# Altium schematic sheet BalEv_FPTG_POW_COFIG_v1_0.SchDoc
size A4; CompanyName: HESSO; Address1: Route du Rawyl 47; Address2: 1950 Sion; Address3: Switzerland; DocumentNumber: 5; SheetNumber: 4; SheetTotal: 8; PageSetup: Record=PageOptions|CenterHorizontal=True|CenterVertical=True|PrintScale=1.00|XCorrection=1.00|YCorrection=1.00|PrintKind=1|BorderSize=5000000|LeftOffset=0|BottomOffset=0|Orientation=2|PaperLength=1000|PaperWidth=1000|Scale=100|PaperSource=15|PrintQuality=1200|MediaType=1|DitherType=10|PrintScaleMode=1|PaperKind=A4|PaperIndex=9; ProjectName: Project Name
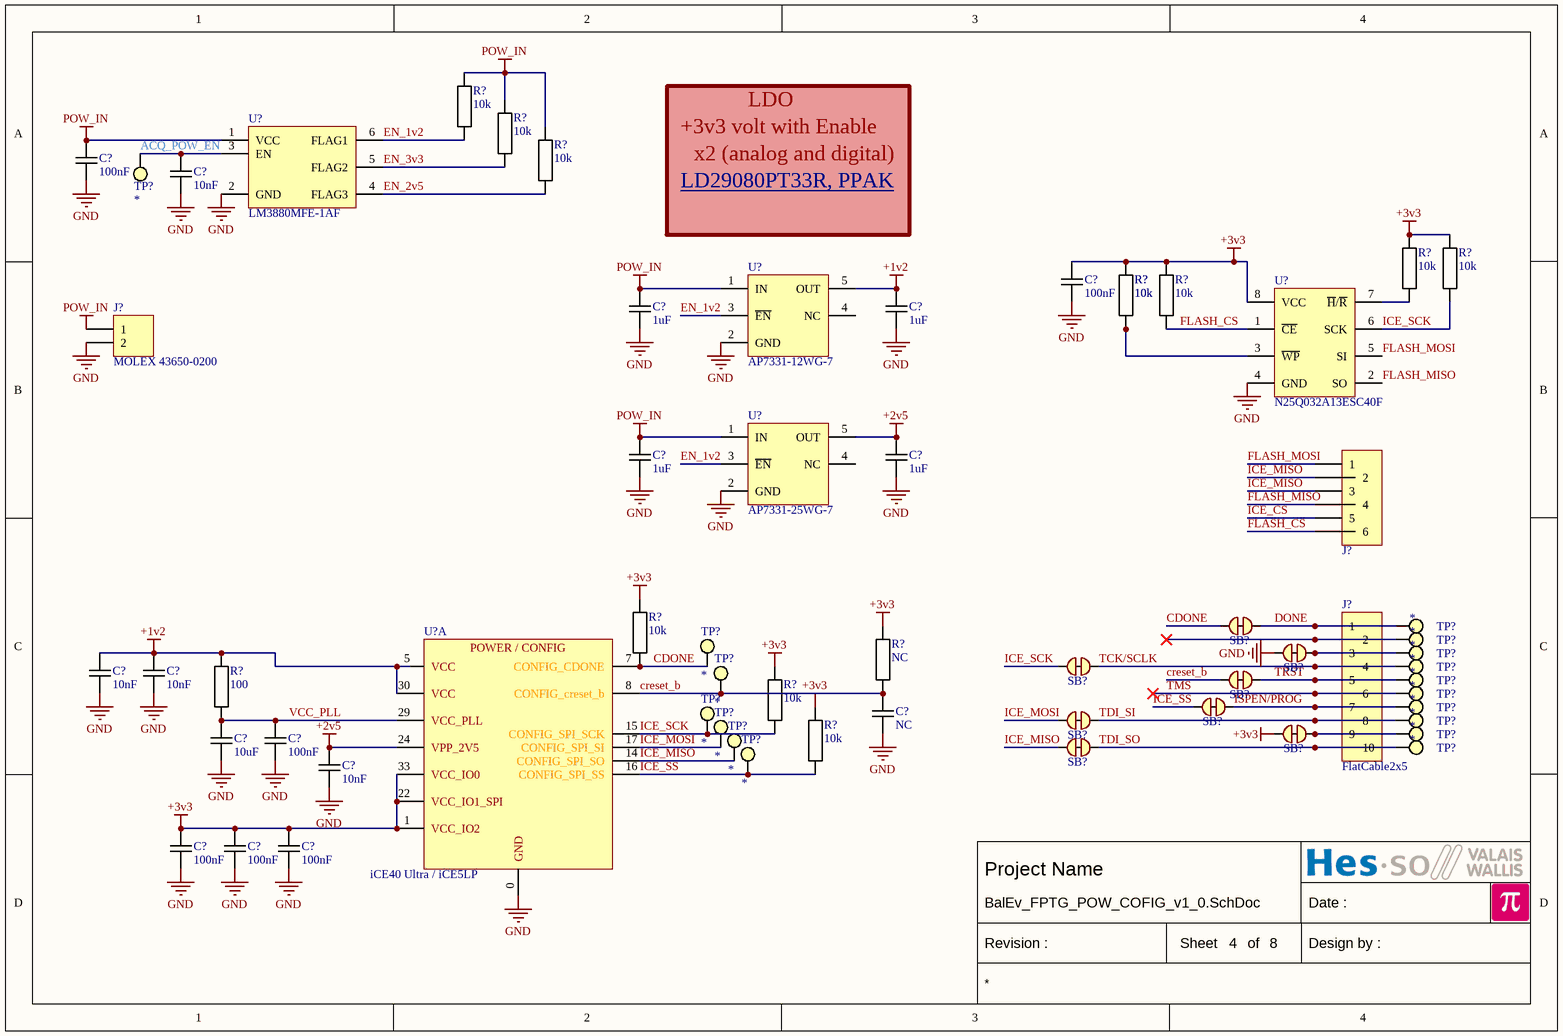
[diagram p0: BalEv_FPTG_POW_COFIG_v1_0.SchDoc]

## Parts
(Parts that share a designator on the sheet are numbered #1, #2 ... from top to bottom, then left to right.)
C?#1  100nF  [CAPACITOR 1005 REFLOW]
C?#2  10nF  [CAPACITOR 1005 REFLOW]
C?#3  100nF  [CAPACITOR 1005 REFLOW]
C?#4  1uF  [CAPACITOR 1608 REFLOW]
C?#5  1uF  [CAPACITOR 1608 REFLOW]
C?#6  1uF  [CAPACITOR 1608 REFLOW]
C?#7  1uF  [CAPACITOR 1608 REFLOW]
C?#8  10nF  [CAPACITOR 1005 REFLOW]
C?#9  10nF  [CAPACITOR 1005 REFLOW]
C?#10  NC  [CAPACITOR 1005 REFLOW]
C?#11  10uF  [CAPACITOR 1608 REFLOW]
C?#12  100nF  [CAPACITOR 1005 REFLOW]
C?#13  10nF  [CAPACITOR 1005 REFLOW]
C?#14  100nF  [CAPACITOR 1005 REFLOW]
C?#15  100nF  [CAPACITOR 1005 REFLOW]
C?#16  100nF  [CAPACITOR 1005 REFLOW]
J?#1  MOLEX 43650-0200  [MOLEX 43650-0200]
J?#2  *  [PinHeader2x3 P2.54]  (value not drawn)
J?#3  FlatCable2x5  [FlatCable2x5 2MM Straight TH FCI 98414-G06-10ULF]
R?#1  10k  [RESISTOR 1005 REFLOW]
R?#2  10k  [RESISTOR 1005 REFLOW]
R?#3  10k  [RESISTOR 1005 REFLOW]
R?#4  10k  [RESISTOR 1005 REFLOW]
R?#5  10k  [RESISTOR 1005 REFLOW]
R?#6  10k  [RESISTOR 1005 REFLOW]
R?#7  10k  [RESISTOR 1005 REFLOW]
R?#8  10k  [RESISTOR 1005 REFLOW]
R?#9  10k  [RESISTOR 1005 REFLOW]
R?#10  NC  [RESISTOR 1005 REFLOW]
R?#11  100  [RESISTOR 1005 REFLOW]
R?#12  10k  [RESISTOR 1005 REFLOW]
R?#13  10k  [RESISTOR 1005 REFLOW]
SB?#1  *  [Solder Bridge 1mm Connected]  (value not drawn)  (net tie, no BOM)
SB?#2  *  [Solder Bridge 1mm Connected]  (value not drawn)  (net tie, no BOM)
SB?#3  *  [Solder Bridge 1mm Connected]  (value not drawn)  (net tie, no BOM)
SB?#4  *  [Solder Bridge 1mm Connected]  (value not drawn)  (net tie, no BOM)
SB?#5  *  [Solder Bridge 1mm Connected]  (value not drawn)  (net tie, no BOM)
SB?#6  *  [Solder Bridge 1mm Connected]  (value not drawn)  (net tie, no BOM)
SB?#7  *  [Solder Bridge 1mm Connected]  (value not drawn)  (net tie, no BOM)
SB?#8  *  [Solder Bridge 1mm Connected]  (value not drawn)  (net tie, no BOM)
TP?#1  *  [Hole 0.25 D0.8]  (no BOM)
TP?#2  *  [Hole 0.25 D0.8]  (no BOM)
TP?#3  *  [Hole 0.25 D0.8]  (no BOM)
TP?#4  *  [Hole 0.25 D0.8]  (no BOM)
TP?#5  *  [Hole 0.25 D0.8]  (no BOM)
TP?#6  *  [Hole 0.25 D0.8]  (no BOM)
TP?#7  *  [Hole 0.25 D0.8]  (no BOM)
TP?#8  *  [Hole 0.25 D0.8]  (no BOM)
TP?#9  *  [Hole 0.25 D0.8]  (no BOM)
TP?#10  *  [Hole 0.25 D0.8]  (no BOM)
TP?#11  *  [Hole 0.25 D0.8]  (no BOM)
TP?#12  *  [Hole 0.25 D0.8]  (no BOM)
TP?#13  *  [Hole 0.25 D0.8]  (no BOM)
TP?#14  *  [Hole 0.25 D0.8]  (no BOM)
TP?#15  *  [Hole 0.25 D0.8]  (no BOM)
TP?#16  *  [Hole 0.25 D0.8]  (no BOM)
TP?#17  *  [Hole 0.25 D0.8]  (no BOM)
U?#1  LM3880MFE-1AF  [SC70-6 P0.65 C1.4x2.2 H1.0]
U?#2  AP7331-12WG-7  [SOT23-5 P0.95 C1.6x3.0 H1.3]
U?#3  N25Q032A13ESC40F  [SO8 P1.27 C4.0X5.0 H1.75]
U?#4  AP7331-25WG-7  [SOT23-5 P0.95 C1.6x3.0 H1.3]
U?#5  iCE40 Ultra / iCE5LP  [QFN50P700X700X100_HS-49N]  (part A of 4)

## Nets
+1v2: C?#5.2 C?#8.2 C?#9.2 R?#11.2 U?#2.5(OUT) U?#5.5(VCC) U?#5.30(VCC)
+2v5: C?#7.2 C?#13.2 U?#4.5(OUT) U?#5.24(VPP_2V5)
+3v3: C?#3.2 C?#14.2 C?#15.2 C?#16.2 R?#4.2 R?#5.2 R?#6.2 R?#7.2 R?#8.2 R?#9.2 R?#10.2 R?#12.2 R?#13.2 SB?#7.2 U?#3.8(VCC) U?#5.1(VCC_IO2) U?#5.22(VCC_IO1_SPI) U?#5.33(VCC_IO0)
GND: C?#1.1 C?#2.1 C?#3.1 C?#4.1 C?#5.1 C?#6.1 C?#7.1 C?#8.1 C?#9.1 C?#10.1 C?#11.1 C?#12.1 C?#13.1 C?#14.1 C?#15.1 C?#16.1 J?#1.2 SB?#2.2 U?#1.2(GND) U?#2.2(GND) U?#3.4(GND) U?#4.2(GND) U?#5.0(GND)
POW_IN: C?#1.2 C?#4.2 C?#6.2 J?#1.1 R?#1.2 R?#2.2 R?#3.2 U?#1.1(VCC) U?#2.1(IN) U?#4.1(IN)
ACQ_POW_EN: C?#2.2 TP?#1.1 U?#1.3(EN)
CDONE: R?#9.1 SB?#1.2 TP?#5.1 U?#5.7(CONFIG_CDONE)
creset_b: C?#10.2 R?#10.1 SB?#4.2 TP?#8.1 U?#5.8(CONFIG_creset_b)
DONE: J?#3.1 SB?#1.1 TP?#2.1
EN_1v2: R?#1.1 U?#1.6(FLAG1) U?#2.3(~{EN}) U?#4.3(~{EN})
EN_2v5: R?#3.1 U?#1.4(FLAG3)
EN_3v3: R?#2.1 U?#1.5(FLAG2)
FLASH_CS: J?#2.6 R?#8.1 U?#3.1(~{CE})
FLASH_MISO: J?#2.4 U?#3.2(SO)
FLASH_MOSI: J?#2.1 U?#3.5(SI)
ICE_CS: J?#2.5
ICE_MISO: J?#2.2 J?#2.3 SB?#8.2 TP?#16.1 U?#5.14(CONFIG_SPI_SO)
ICE_MOSI: SB?#6.2 TP?#14.1 U?#5.17(CONFIG_SPI_SI)
ICE_SCK: R?#5.1 R?#12.1 SB?#3.2 TP?#12.1 U?#3.6(SCK) U?#5.15(CONFIG_SPI_SCK)
ICE_SS: R?#13.1 SB?#5.2 TP?#17.1 U?#5.16(CONFIG_SPI_SS)
ISPEN/PROG: J?#3.7 SB?#5.1 TP?#10.1
TCK/SCLK: J?#3.4 SB?#3.1 TP?#6.1
TDI_SI: J?#3.8 SB?#6.1 TP?#11.1
TDI_SO: J?#3.10 SB?#8.1 TP?#15.1
TMS: J?#3.6 TP?#9.1
TRST: J?#3.5 SB?#4.1 TP?#7.1
VCC_PLL: C?#11.2 C?#12.2 R?#11.1 U?#5.29(VCC_PLL)
NetJ?#3_2: J?#3.2 TP?#3.1
NetJ?#3_3: J?#3.3 SB?#2.1 TP?#4.1
NetJ?#3_9: J?#3.9 SB?#7.1 TP?#13.1
NetR?#4_1: R?#4.1 U?#3.7(~{H}/~{R})
NetR?#6_1: R?#6.1 R?#7.1 U?#3.3(~{WP})

Not connected (* = marked no-connect by the designer): U?#2 4(NC); U?#4 4(NC)

## Notes on the sheet
- LDO
- +3v3 volt with Enable
- x2 (analog and digital)
- LD29080PT33R, PPAK <https://www.st.com/content/ccc/resource/technical/document/datasheet/b1/ba/31/d4/6e/d9/46/02/CD00044919.pdf/files/CD00044919.pdf/jcr:content/translations/en.CD00044919.pdf>
- Date :
- Revision :
- Sheet
- of
- Design by :
- (in symbol ICE5LP1K-SG48, part A) POWER / CONFIG

## Library data of the parts
C?#1-C?#16 = Capacitor
  C?#1 C?#3 C?#12 C?#14-C?#16: Value: 100nF
  C?#2 C?#8 C?#9 C?#13: Value: 10nF
  C?#4-C?#7: Value: 1uF
  C?#10: Value: NC
  C?#11: Value: 10uF
J?#1 = MOLEX 43650-0200: Micro-Fit 3.0 Right-Angle Header, 3.00mm Pitch, Single Row, 2 Circuits
J?#2 = PinHeader2x3: Plug connector; Value: *
J?#3 = FlatCable2x5: FlatCable2x5 (FCS-12-SG, FCS-10-SG, MHR-10-VUAL)
R?#1-R?#13 = Resistor
  R?#1-R?#9 R?#12 R?#13: Value: 10k
  R?#10: Value: NC
  R?#11: Value: 100
SB?#1-SB?#8 = Solderbridge Connected: Value: *
TP?#1-TP?#17 = Hole: Value: *
U?#1 = LM3880MF-1__: Three-Rail Simple Power Supply Sequencer; Value: LM3880MFE-1AF
U?#2 U?#4 = REGPOS SOT23-5 IN,GND,EN,NC,OUT: Generic Positive Voltage Regulator
  U?#2: Value: AP7331-12WG-7
  U?#4: Value: AP7331-25WG-7
U?#3 = IS25LP064D-JB: 32Mb Serial Flash Memory; Value: N25Q032A13ESC40F
U?#5 = ICE5LP1K-SG48